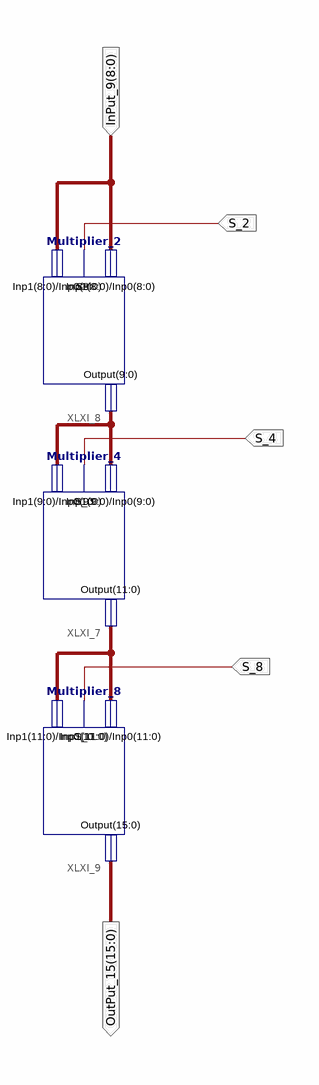
[diagram p0: schematic sheet 1]
// Xilinx ISE schematic Multiplier.sch (spartan3e) as structural Verilog: 3 symbols, 5 ports
module Multiplier (
  input  S_2,
  input  S_4,
  input  S_8,
  input  [8:0] InPut_9,
  output [15:0] OutPut_15
);

  wire [9:0] XLXN_6;
  wire [11:0] XLXN_7;

  Multiplier_4 XLXI_7 (.Inp1(XLXN_6), .Inp0(XLXN_6), .S_0(S_4), .Output(XLXN_7));
  Multiplier_2 XLXI_8 (.Inp1(InPut_9), .Sel(S_2), .Inp0(InPut_9), .Output(XLXN_6));
  Multiplier_8 XLXI_9 (.Inp1(XLXN_7), .Inp0(XLXN_7), .S_0(S_8), .Output(OutPut_15));
endmodule
